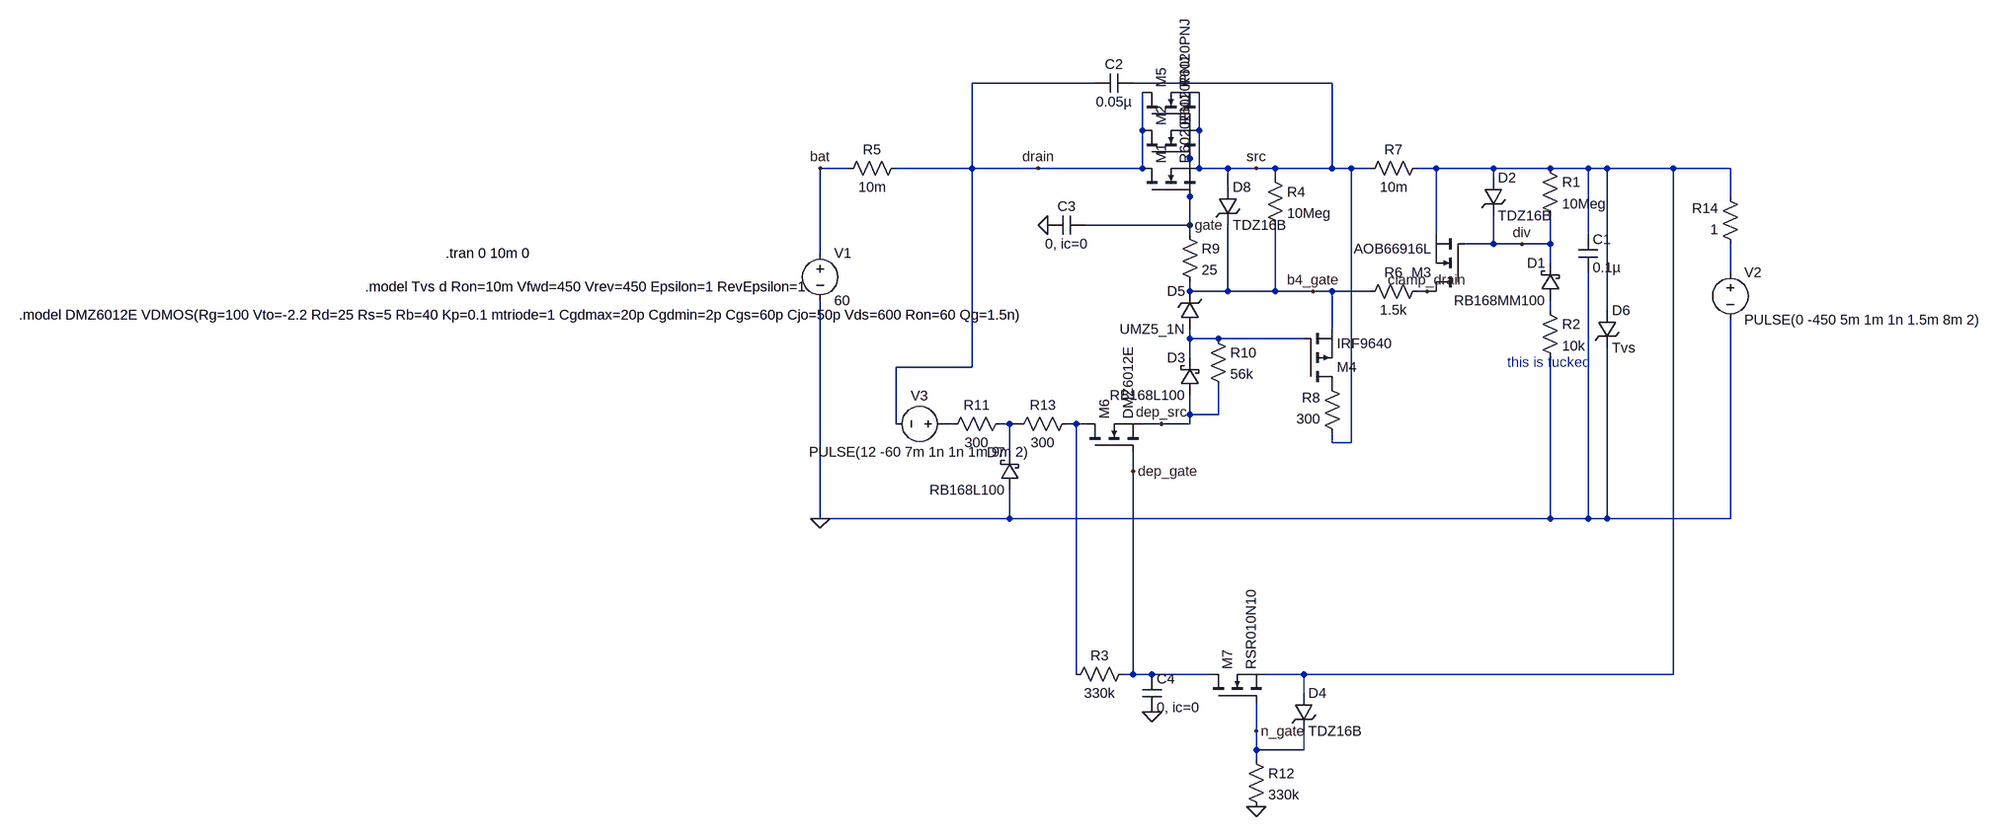
[diagram p0: schematic FET Driver rev5 fuck_yeah.asc]
FET Driver rev5 fuck_yeah.asc, the LTspice schematic file:
Version 4
SHEET 1 1884 1264
WIRE 0 -112 -208 -112
WIRE 400 -112 64 -112
WIRE 80 -32 80 -96
WIRE 176 -32 176 -96
WIRE 160 16 160 -48
WIRE -416 32 -464 32
WIRE -208 32 -208 -112
WIRE -208 32 -336 32
WIRE -96 32 -208 32
WIRE 80 32 80 -32
WIRE 80 32 -96 32
WIRE 176 32 176 -32
WIRE 224 32 176 32
WIRE 272 32 224 32
WIRE 304 32 272 32
WIRE 400 32 400 -112
WIRE 400 32 304 32
WIRE 432 32 400 32
WIRE 464 32 432 32
WIRE 576 32 544 32
WIRE 672 32 576 32
WIRE 768 32 672 32
WIRE 832 32 768 32
WIRE 864 32 832 32
WIRE 976 32 864 32
WIRE 1072 32 976 32
WIRE 304 48 304 32
WIRE 672 48 672 32
WIRE 224 64 224 32
WIRE 160 80 160 16
WIRE 1072 80 1072 32
WIRE 160 128 160 80
WIRE 160 128 -16 128
WIRE 160 144 160 128
WIRE 576 144 576 32
WIRE 832 144 832 32
WIRE 672 160 672 112
WIRE 672 160 624 160
WIRE 720 160 672 160
WIRE 768 160 768 112
WIRE 768 160 720 160
WIRE -464 176 -464 32
WIRE 768 192 768 160
WIRE 1072 208 1072 160
WIRE 160 240 160 224
WIRE 224 240 224 128
WIRE 224 240 160 240
WIRE 304 240 304 128
WIRE 304 240 224 240
WIRE 368 240 304 240
WIRE 400 240 368 240
WIRE 464 240 400 240
WIRE 560 240 544 240
WIRE 576 240 560 240
WIRE 768 272 768 256
WIRE 864 272 864 32
WIRE 400 304 400 240
WIRE 160 320 160 304
WIRE 208 320 160 320
WIRE 352 320 208 320
WIRE 160 352 160 320
WIRE -208 368 -208 32
WIRE -208 368 -336 368
WIRE 160 448 160 416
WIRE 208 448 208 400
WIRE 208 448 160 448
WIRE -336 464 -336 368
WIRE -240 464 -256 464
WIRE -144 464 -160 464
WIRE -128 464 -144 464
WIRE -32 464 -48 464
WIRE -16 464 -32 464
WIRE 112 464 80 464
WIRE 160 464 160 448
WIRE 160 464 112 464
WIRE 400 496 400 480
WIRE 432 496 432 32
WIRE 432 496 400 496
WIRE -144 512 -144 464
WIRE 64 544 64 512
WIRE -464 624 -464 256
WIRE -144 624 -144 576
WIRE -144 624 -464 624
WIRE 768 624 768 352
WIRE 768 624 -144 624
WIRE 832 624 832 208
WIRE 832 624 768 624
WIRE 864 624 864 336
WIRE 864 624 832 624
WIRE 1072 624 1072 288
WIRE 1072 624 864 624
WIRE -32 992 -32 464
WIRE 64 992 64 544
WIRE 64 992 48 992
WIRE 96 992 64 992
WIRE 192 992 96 992
WIRE 352 992 288 992
WIRE 976 992 976 32
WIRE 976 992 352 992
WIRE 352 1024 352 992
WIRE 272 1088 272 1040
WIRE 272 1120 272 1088
WIRE 352 1120 352 1088
WIRE 352 1120 272 1120
WIRE 272 1136 272 1120
FLAG 720 160 div
FLAG 272 32 src
FLAG 160 128 gate
FLAG -464 624 0
FLAG -80 128 0
FLAG -96 32 drain
FLAG -464 32 bat
FLAG 96 1056 0
FLAG 64 544 dep_gate
FLAG 272 1088 n_gate
FLAG 112 464 dep_src
FLAG 368 240 b4_gate
FLAG 560 240 clamp_drain
FLAG 272 1216 0
SYMBOL nmos 80 80 R270
SYMATTR InstName M1
SYMATTR Value R6020PNJ
SYMBOL voltage -464 160 R0
WINDOW 123 0 0 Left 0
WINDOW 39 0 0 Left 0
SYMATTR InstName V1
SYMATTR Value 60
SYMBOL voltage 1072 192 R0
WINDOW 123 0 0 Left 0
WINDOW 39 0 0 Left 0
SYMATTR InstName V2
SYMATTR Value PULSE(0 -450 5m 1m 1n 1.5m 8m 2)
SYMBOL res 752 16 R0
SYMATTR InstName R1
SYMATTR Value 10Meg
SYMBOL schottky 784 256 R180
WINDOW 0 24 64 Left 2
WINDOW 3 24 0 Left 2
SYMATTR InstName D1
SYMATTR Value RB168MM100
SYMATTR Description Diode
SYMATTR Type diode
SYMBOL res 752 256 R0
SYMATTR InstName R2
SYMATTR Value 10k
SYMBOL zener 656 48 R0
SYMATTR InstName D2
SYMATTR Value TDZ16B
SYMATTR Description Diode
SYMATTR Type diode
SYMBOL nmos 624 240 R180
SYMATTR InstName M3
SYMATTR Value AOB66916L
SYMBOL voltage -240 464 R90
WINDOW 0 -32 56 VBottom 2
WINDOW 3 32 56 VTop 2
WINDOW 123 0 0 Left 0
WINDOW 39 0 0 Left 0
SYMATTR InstName V3
SYMATTR Value PULSE(12 -60 7m 1n 1n 1m 9m 2)
SYMBOL res -432 48 R270
WINDOW 0 32 56 VTop 2
WINDOW 3 0 56 VBottom 2
SYMATTR InstName R5
SYMATTR Value 10m
SYMBOL res 560 224 R90
WINDOW 0 0 56 VBottom 2
WINDOW 3 32 56 VTop 2
SYMATTR InstName R6
SYMATTR Value 1.5k
SYMBOL res 288 32 R0
SYMATTR InstName R4
SYMATTR Value 10Meg
SYMBOL zener 176 304 R180
WINDOW 0 24 64 Left 2
WINDOW 3 24 0 Left 2
SYMATTR InstName D5
SYMATTR Value UMZ5_1N
SYMATTR Description Diode
SYMATTR Type diode
SYMBOL pmos 352 400 M180
SYMATTR InstName M4
SYMATTR Value IRF9640
SYMBOL res 416 496 R180
WINDOW 0 36 76 Left 2
WINDOW 3 36 40 Left 2
SYMATTR InstName R8
SYMATTR Value 300
SYMBOL TVSdiode 848 272 R0
SYMATTR InstName D6
SYMATTR Value Tvs
SYMBOL cap 816 144 R0
SYMATTR InstName C1
SYMATTR Value 0.1µ
SYMBOL cap 64 -128 R90
WINDOW 0 0 32 VBottom 2
WINDOW 3 32 32 VTop 2
SYMATTR InstName C2
SYMATTR Value 0.05µ
SYMBOL res 144 128 R0
SYMATTR InstName R9
SYMATTR Value 25
SYMBOL cap -16 112 R90
WINDOW 0 0 32 VBottom 2
WINDOW 3 32 32 VTop 2
SYMATTR InstName C3
SYMATTR Value 0, ic=0
SYMBOL schottky -128 576 R180
WINDOW 0 24 64 Left 2
WINDOW 3 24 0 Left 2
SYMATTR InstName D7
SYMATTR Value RB168L100
SYMATTR Description Diode
SYMATTR Type diode
SYMBOL res -144 448 R90
WINDOW 0 0 56 VBottom 2
WINDOW 3 32 56 VTop 2
SYMATTR InstName R11
SYMATTR Value 300
SYMBOL nmos 80 16 R270
SYMATTR InstName M2
SYMATTR Value R6020PNJ
SYMBOL nmos 80 -48 R270
SYMATTR InstName M5
SYMATTR Value R6020PNJ
SYMBOL nmos -16 512 R270
SYMATTR InstName M6
SYMATTR Value DMZ6012E
SYMBOL zener 208 64 R0
SYMATTR InstName D8
SYMATTR Value TDZ16B
SYMATTR Description Diode
SYMATTR Type diode
SYMBOL res 64 976 R90
WINDOW 0 0 56 VBottom 2
WINDOW 3 32 56 VTop 2
SYMATTR InstName R3
SYMATTR Value 330k
SYMBOL res 256 1120 R0
SYMATTR InstName R12
SYMATTR Value 330k
SYMBOL zener 336 1024 R0
SYMATTR InstName D4
SYMATTR Value TDZ16B
SYMATTR Description Diode
SYMATTR Type diode
SYMBOL cap 80 992 R0
SYMATTR InstName C4
SYMATTR Value 0, ic=0
SYMBOL res -32 448 R90
WINDOW 0 0 56 VBottom 2
WINDOW 3 32 56 VTop 2
SYMATTR InstName R13
SYMATTR Value 300
SYMBOL nmos 192 1040 R270
SYMATTR InstName M7
SYMATTR Value RSR010N10
SYMBOL res 1088 176 R180
WINDOW 0 36 76 Left 2
WINDOW 3 36 40 Left 2
SYMATTR InstName R14
SYMATTR Value 1
SYMBOL res 560 16 R90
WINDOW 0 0 56 VBottom 2
WINDOW 3 32 56 VTop 2
SYMATTR InstName R7
SYMATTR Value 10m
SYMBOL schottky 176 416 R180
WINDOW 0 24 64 Left 2
WINDOW 3 24 0 Left 2
SYMATTR InstName D3
SYMATTR Value RB168L100
SYMATTR Description Diode
SYMATTR Type diode
SYMBOL res 192 304 R0
SYMATTR InstName R10
SYMATTR Value 56k
TEXT -1096 176 Left 2 !.tran 0 10m 0
TEXT -1232 232 Left 2 !.model Tvs d Ron=10m Vfwd=450 Vrev=450 Epsilon=1 RevEpsilon=1
TEXT -1816 280 Left 2 !.model DMZ6012E VDMOS(Rg=100 Vto=-2.2 Rd=25 Rs=5 Rb=40 Kp=0.1 mtriode=1 Cgdmax=20p Cgdmin=2p Cgs=60p Cjo=50p Vds=600 Ron=60 Qg=1.5n)
TEXT 696 360 Left 2 ;this is fucked

The netlist it stands for:
* FET Driver rev5 fuck_yeah.asc
M1 drain gate src src R6020PNJ
V1 bat 0 60
V2 N002 0 PULSE(0 -450 5m 1m 1n 1.5m 8m 2)
R1 N001 div 10Meg
D1 N003 div RB168MM100
R2 N003 0 10k
D2 N001 div TDZ16B
M3 clamp_drain div N001 N001 AOB66916L
V3 N005 drain PULSE(12 -60 7m 1n 1n 1m 9m 2)
R5 bat drain 10m
R6 clamp_drain b4_gate 1.5k
R4 src b4_gate 10Meg
D5 N004 b4_gate UMZ5_1N
M4 P001 N004 b4_gate b4_gate IRF9640
R8 src P001 300
D6 N001 0 Tvs
C1 N001 0 0.1µ
C2 src drain 0.05µ
R9 gate b4_gate 25
C3 gate 0 0, ic=0
D7 0 N006 RB168L100
R11 N006 N005 300
M2 drain gate src src R6020PNJ
M5 drain gate src src R6020PNJ
M6 N007 dep_gate dep_src dep_src DMZ6012E
D8 src b4_gate TDZ16B
R3 dep_gate N007 330k
R12 n_gate 0 330k
D4 N001 n_gate TDZ16B
C4 dep_gate 0 0, ic=0
R13 N007 N006 300
M7 dep_gate n_gate N001 N001 RSR010N10
R14 N002 N001 1
R7 N001 src 10m
D3 dep_src N004 RB168L100
R10 N004 dep_src 56k
.model D D
.lib standard.dio
.model NMOS NMOS
.model PMOS PMOS
.lib standard.mos
.tran 0 10m 0
.model Tvs d Ron=10m Vfwd=450 Vrev=450 Epsilon=1 RevEpsilon=1
.model DMZ6012E VDMOS(Rg=100 Vto=-2.2 Rd=25 Rs=5 Rb=40 Kp=0.1 mtriode=1 Cgdmax=20p Cgdmin=2p Cgs=60p Cjo=50p Vds=600 Ron=60 Qg=1.5n)
* this is fucked
.backanno
.end